# EAGLE schematic PGTN021_octasource_controls (EAGLE 8.5.2)
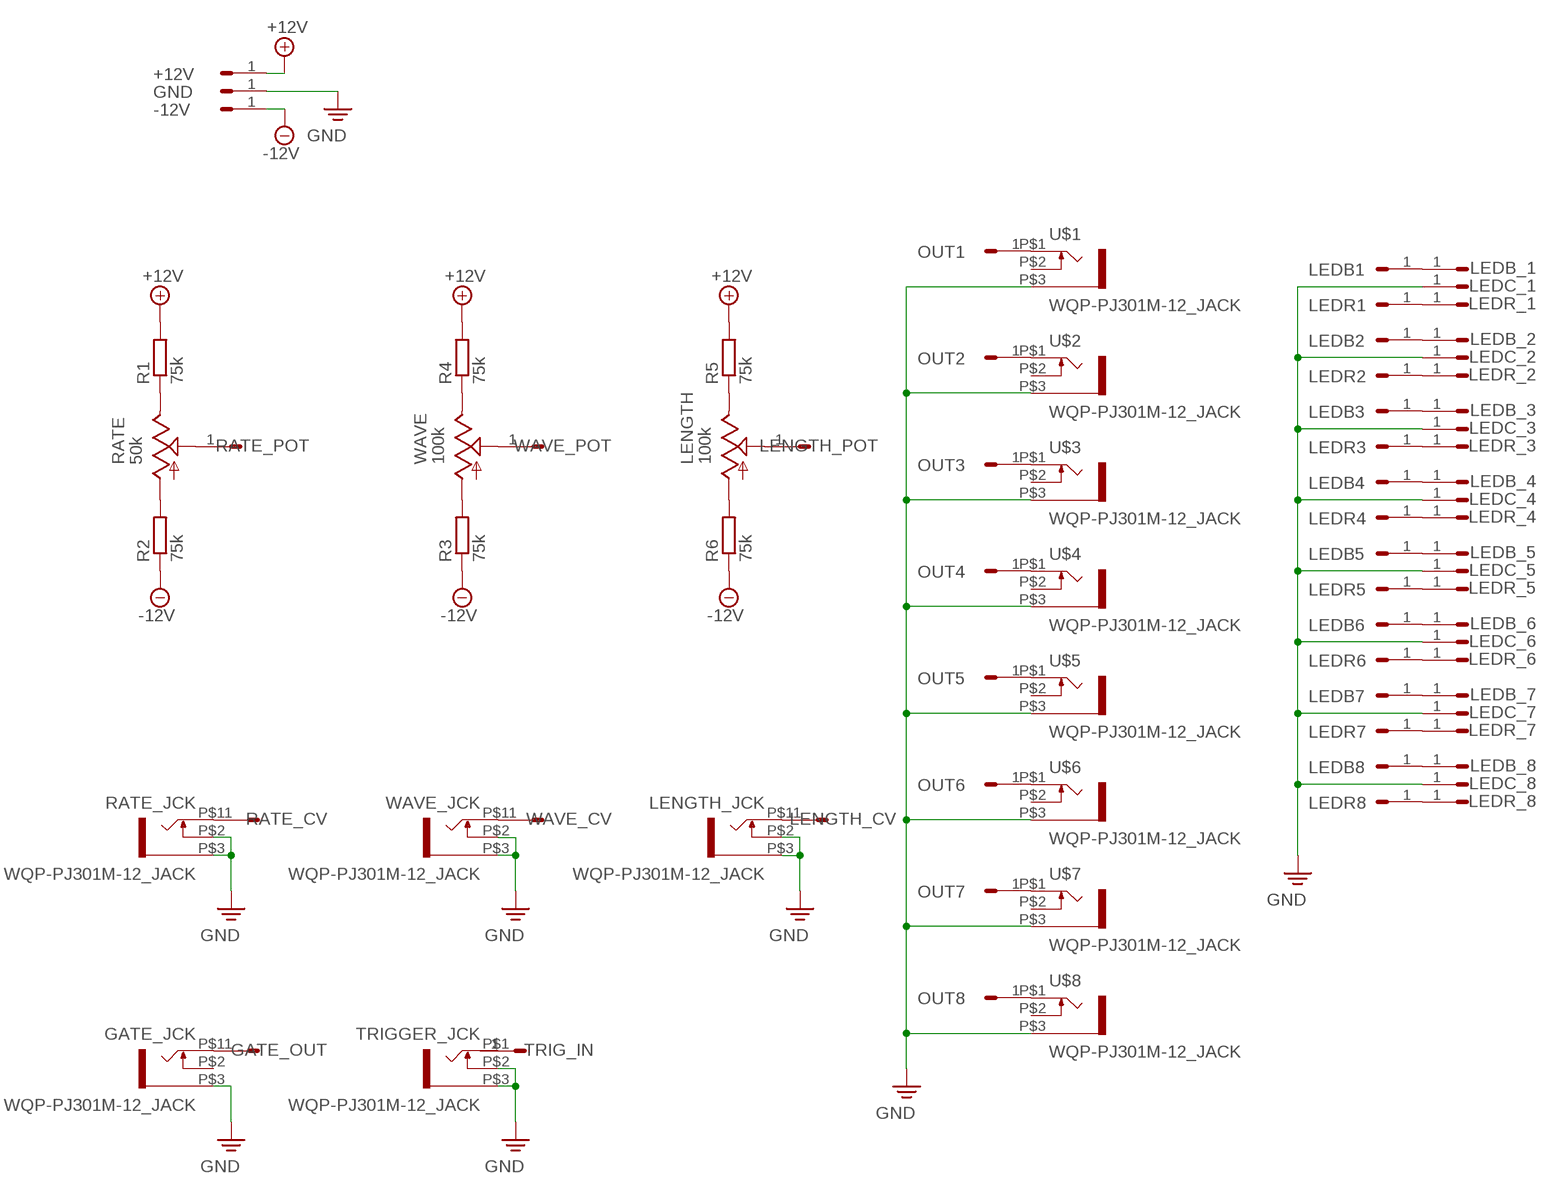
[diagram p0: schematic, sheet 1]

## Parts
+12V  HEADER/MALE/01  [HEADER/MALE/01]
-12V  HEADER/MALE/01  [HEADER/MALE/01]
GATE_JCK  WQP-PJ301M-12_JACK  [WQP-PJ301M-12_JACK]
GATE_OUT  HEADER/MALE/01  [HEADER/MALE/01]
GND  HEADER/MALE/01  [HEADER/MALE/01]
LEDB1  HEADER/MALE/01  [HEADER/MALE/01]
LEDB2  HEADER/MALE/01  [HEADER/MALE/01]
LEDB3  HEADER/MALE/01  [HEADER/MALE/01]
LEDB4  HEADER/MALE/01  [HEADER/MALE/01]
LEDB5  HEADER/MALE/01  [HEADER/MALE/01]
LEDB6  HEADER/MALE/01  [HEADER/MALE/01]
LEDB7  HEADER/MALE/01  [HEADER/MALE/01]
LEDB8  HEADER/MALE/01  [HEADER/MALE/01]
LEDB_1  HEADER/MALE/01  [HEADER/MALE/01]
LEDB_2  HEADER/MALE/01  [HEADER/MALE/01]
LEDB_3  HEADER/MALE/01  [HEADER/MALE/01]
LEDB_4  HEADER/MALE/01  [HEADER/MALE/01]
LEDB_5  HEADER/MALE/01  [HEADER/MALE/01]
LEDB_6  HEADER/MALE/01  [HEADER/MALE/01]
LEDB_7  HEADER/MALE/01  [HEADER/MALE/01]
LEDB_8  HEADER/MALE/01  [HEADER/MALE/01]
LEDC_1  HEADER/MALE/01  [HEADER/MALE/01]
LEDC_2  HEADER/MALE/01  [HEADER/MALE/01]
LEDC_3  HEADER/MALE/01  [HEADER/MALE/01]
LEDC_4  HEADER/MALE/01  [HEADER/MALE/01]
LEDC_5  HEADER/MALE/01  [HEADER/MALE/01]
LEDC_6  HEADER/MALE/01  [HEADER/MALE/01]
LEDC_7  HEADER/MALE/01  [HEADER/MALE/01]
LEDC_8  HEADER/MALE/01  [HEADER/MALE/01]
LEDR1  HEADER/MALE/01  [HEADER/MALE/01]
LEDR2  HEADER/MALE/01  [HEADER/MALE/01]
LEDR3  HEADER/MALE/01  [HEADER/MALE/01]
LEDR4  HEADER/MALE/01  [HEADER/MALE/01]
LEDR5  HEADER/MALE/01  [HEADER/MALE/01]
LEDR6  HEADER/MALE/01  [HEADER/MALE/01]
LEDR7  HEADER/MALE/01  [HEADER/MALE/01]
LEDR8  HEADER/MALE/01  [HEADER/MALE/01]
LEDR_1  HEADER/MALE/01  [HEADER/MALE/01]
LEDR_2  HEADER/MALE/01  [HEADER/MALE/01]
LEDR_3  HEADER/MALE/01  [HEADER/MALE/01]
LEDR_4  HEADER/MALE/01  [HEADER/MALE/01]
LEDR_5  HEADER/MALE/01  [HEADER/MALE/01]
LEDR_6  HEADER/MALE/01  [HEADER/MALE/01]
LEDR_7  HEADER/MALE/01  [HEADER/MALE/01]
LEDR_8  HEADER/MALE/01  [HEADER/MALE/01]
LENGTH  100k  9MM_SNAP-IN_POT_  [9MM_SNAP-IN_POT]
LENGTH_CV  HEADER/MALE/01  [HEADER/MALE/01]
LENGTH_JCK  WQP-PJ301M-12_JACK  [WQP-PJ301M-12_JACK]
LENGTH_POT  HEADER/MALE/01  [HEADER/MALE/01]
OUT1  HEADER/MALE/01  [HEADER/MALE/01]
OUT2  HEADER/MALE/01  [HEADER/MALE/01]
OUT3  HEADER/MALE/01  [HEADER/MALE/01]
OUT4  HEADER/MALE/01  [HEADER/MALE/01]
OUT5  HEADER/MALE/01  [HEADER/MALE/01]
OUT6  HEADER/MALE/01  [HEADER/MALE/01]
OUT7  HEADER/MALE/01  [HEADER/MALE/01]
OUT8  HEADER/MALE/01  [HEADER/MALE/01]
R1  75k  RESISTORRESISTOR/UPRIGHT/7.5  [RESISTOR/7.5]
R2  75k  RESISTORRESISTOR/UPRIGHT/7.5  [RESISTOR/7.5]
R3  75k  RESISTORRESISTOR/UPRIGHT/7.5  [RESISTOR/7.5]
R4  75k  RESISTORRESISTOR/UPRIGHT/7.5  [RESISTOR/7.5]
R5  75k  RESISTORRESISTOR/UPRIGHT/7.5  [RESISTOR/7.5]
R6  75k  RESISTORRESISTOR/UPRIGHT/7.5  [RESISTOR/7.5]
RATE  50k  9MM_SNAP-IN_POT_  [9MM_SNAP-IN_POT]
RATE_CV  HEADER/MALE/01  [HEADER/MALE/01]
RATE_JCK  WQP-PJ301M-12_JACK  [WQP-PJ301M-12_JACK]
RATE_POT  HEADER/MALE/01  [HEADER/MALE/01]
TRIG_IN  HEADER/MALE/01  [HEADER/MALE/01]
TRIGGER_JCK  WQP-PJ301M-12_JACK  [WQP-PJ301M-12_JACK]
U$1  WQP-PJ301M-12_JACK  [WQP-PJ301M-12_JACK]
U$2  WQP-PJ301M-12_JACK  [WQP-PJ301M-12_JACK]
U$3  WQP-PJ301M-12_JACK  [WQP-PJ301M-12_JACK]
U$4  WQP-PJ301M-12_JACK  [WQP-PJ301M-12_JACK]
U$5  WQP-PJ301M-12_JACK  [WQP-PJ301M-12_JACK]
U$6  WQP-PJ301M-12_JACK  [WQP-PJ301M-12_JACK]
U$7  WQP-PJ301M-12_JACK  [WQP-PJ301M-12_JACK]
U$8  WQP-PJ301M-12_JACK  [WQP-PJ301M-12_JACK]
WAVE  100k  9MM_SNAP-IN_POT_  [9MM_SNAP-IN_POT]
WAVE_CV  HEADER/MALE/01  [HEADER/MALE/01]
WAVE_JCK  WQP-PJ301M-12_JACK  [WQP-PJ301M-12_JACK]
WAVE_POT  HEADER/MALE/01  [HEADER/MALE/01]

## Nets
+12V: +12V.1 R1.2 R4.2 R5.2
-12V: -12V.1 R2.1 R3.1 R6.1
N$1: R2.2 RATE.1(A)
N$2: R1.1 RATE.3(E)
N$3: RATE_CV.1 RATE_JCK.P$1
N$4: RATE.2(S) RATE_POT.1
N$5: R3.2 WAVE.1(A)
N$6: R4.1 WAVE.3(E)
N$7: WAVE.2(S) WAVE_POT.1
N$8: LENGTH.3(E) R5.1
N$9: LENGTH.1(A) R6.2
N$10: LENGTH.2(S) LENGTH_POT.1
N$11: LENGTH_CV.1 LENGTH_JCK.P$1
N$12: WAVE_CV.1 WAVE_JCK.P$1
N$13: GATE_JCK.P$1 GATE_OUT.1
N$14: OUT1.1 U$1.P$1
N$15: OUT2.1 U$2.P$1
N$16: OUT3.1 U$3.P$1
N$17: OUT4.1 U$4.P$1
N$18: OUT5.1 U$5.P$1
N$19: OUT6.1 U$6.P$1
N$20: OUT7.1 U$7.P$1
N$21: OUT8.1 U$8.P$1
N$22: LEDB1.1 LEDB_1.1
N$23: LEDB2.1 LEDB_2.1
N$24: LEDB3.1 LEDB_3.1
N$25: LEDB4.1 LEDB_4.1
N$26: LEDB5.1 LEDB_5.1
N$27: LEDB6.1 LEDB_6.1
N$28: LEDB7.1 LEDB_7.1
N$29: LEDB8.1 LEDB_8.1
N$30: LEDR1.1 LEDR_1.1
N$31: LEDR2.1 LEDR_2.1
N$32: LEDR3.1 LEDR_3.1
N$33: LEDR4.1 LEDR_4.1
N$34: LEDR5.1 LEDR_5.1
N$35: LEDR6.1 LEDR_6.1
N$36: LEDR7.1 LEDR_7.1
N$37: LEDR8.1 LEDR_8.1
PE: GATE_JCK.P$3 GND.1 LEDC_1.1 LEDC_2.1 LEDC_3.1 LEDC_4.1 LEDC_5.1 LEDC_6.1 LEDC_7.1 LEDC_8.1 LENGTH_JCK.P$2 LENGTH_JCK.P$3 RATE_JCK.P$2 RATE_JCK.P$3 TRIGGER_JCK.P$2 TRIGGER_JCK.P$3 U$1.P$3 U$2.P$3 U$3.P$3 U$4.P$3 U$5.P$3 U$6.P$3 U$7.P$3 U$8.P$3 WAVE_JCK.P$2 WAVE_JCK.P$3 ; supply symbol labelled GND
Unconnected: GATE_JCK.P$2 TRIG_IN.1 TRIGGER_JCK.P$1 U$1.P$2 U$2.P$2 U$3.P$2 U$4.P$2 U$5.P$2 U$6.P$2 U$7.P$2 U$8.P$2

## Library data of the parts
+12V -12V GATE_OUT GND LEDB1-LEDB8 LEDB_1-LEDB_8 LEDC_1-LEDC_8 LEDR1-LEDR8 LEDR_1-LEDR_8 LENGTH_CV LENGTH_POT OUT1-OUT8 RATE_CV RATE_POT TRIG_IN WAVE_CV WAVE_POT = connectors:HEADER/MALE/01
GATE_JCK LENGTH_JCK RATE_JCK TRIGGER_JCK U$1-U$8 WAVE_JCK = controls:WQP-PJ301M-12_JACK
LENGTH RATE WAVE = controls:9MM_SNAP-IN_POT: 9mm vertical snap-in pot, Alpha / Panasonic style
R1-R6 = resistors:RESISTOR: RESISTOR, European symbol